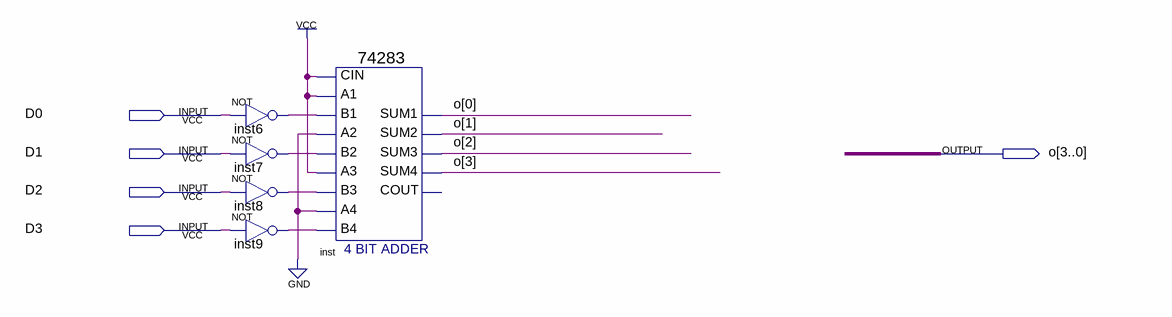
[diagram p0: schematic sheet]
// Quartus schematic yy.bdf as structural Verilog: 5 symbols, 5 pins
module yy (
  input  D0,
  input  D1,
  input  D2,
  input  D3,
  output [3:0] o
);

  wire inst6_out, inst7_out, inst8_out, inst9_out;

  not inst6 (inst6_out, D0);
  not inst7 (inst7_out, D1);
  not inst8 (inst8_out, D2);
  not inst9 (inst9_out, D3);
  \74283  inst (
    .CIN(1'b1), .A1(1'b1), .A2(1'b0), .B2(inst7_out), .A3(1'b1), .A4(1'b0), .B4(inst9_out), .B1(inst6_out),
    .B3(inst8_out), .SUM4(o[3]), .SUM1(o[0]), .SUM2(o[1]), .SUM3(o[2]));  // open: COUT
endmodule
